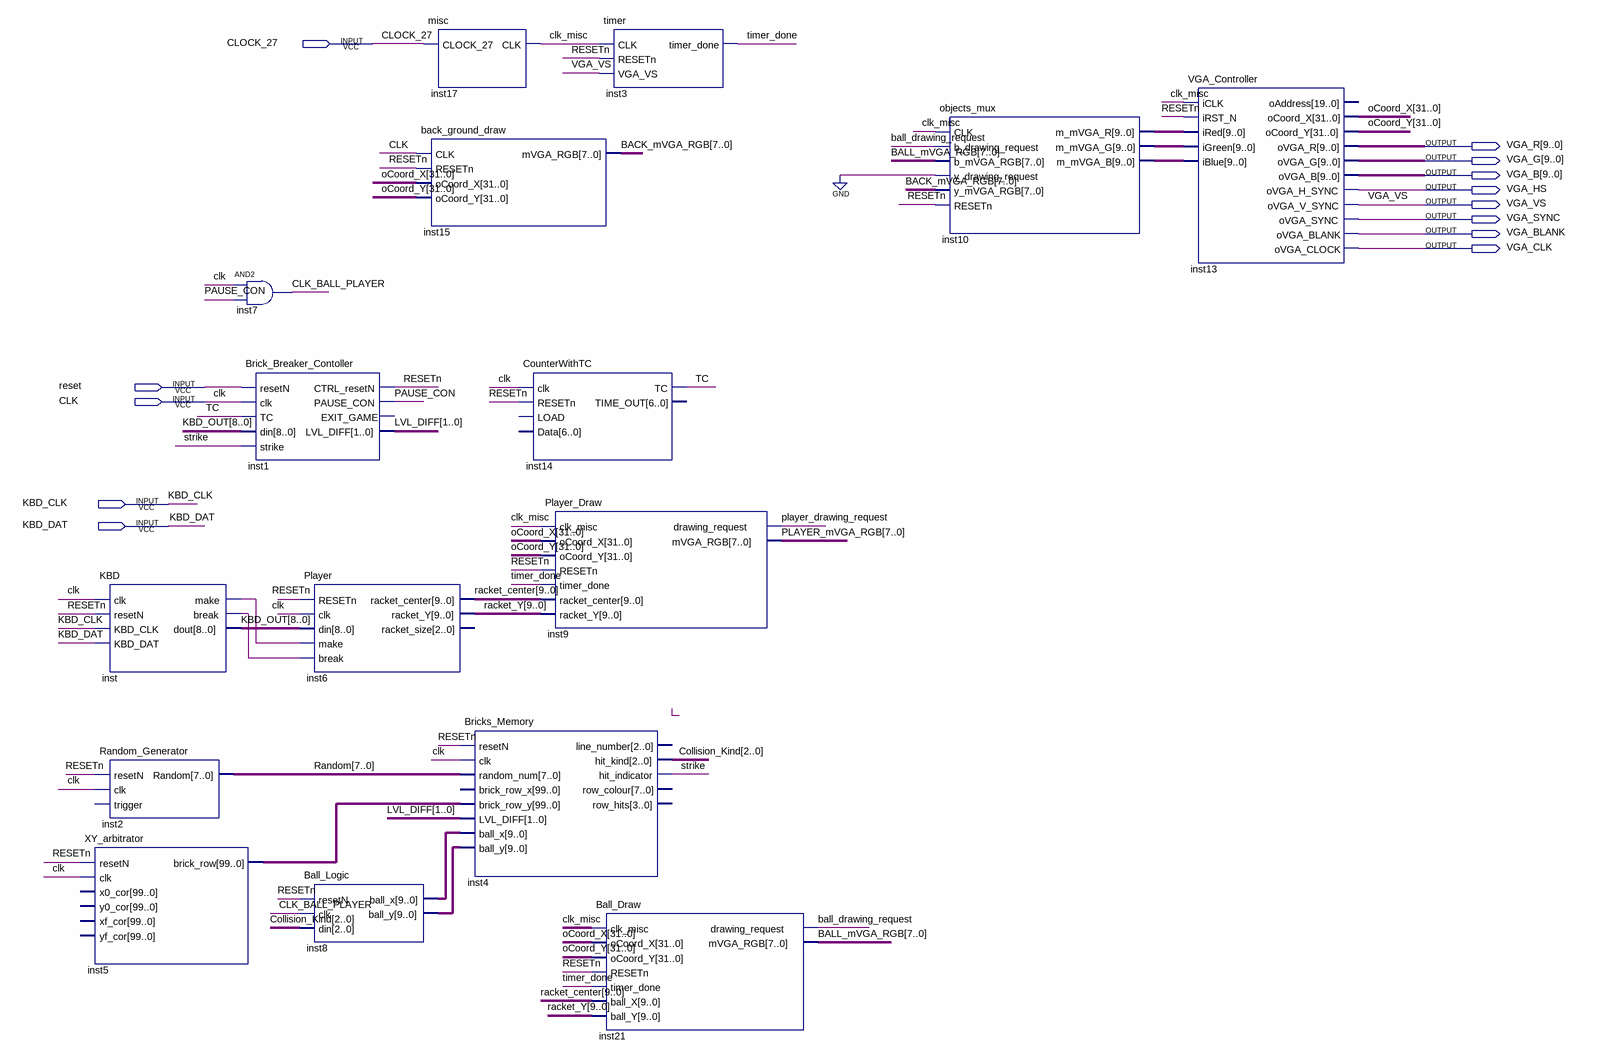
[diagram p0: schematic sheet]
// Quartus schematic Main_Scheme.bdf as structural Verilog: 16 symbols, 13 pins
module Main_Scheme (
  input  CLOCK_27,
  input  reset,
  input  CLK,
  input  KBD_CLK,
  input  KBD_DAT,
  output [9:0] VGA_R,
  output [9:0] VGA_G,
  output [9:0] VGA_B,
  output VGA_HS,
  output VGA_VS,
  output VGA_SYNC,
  output VGA_BLANK,
  output VGA_CLK
);

  wire ball_drawing_request, CLK_BALL_PLAYER, clk_misc, inst_break, inst_make, PAUSE_CON,
       player_drawing_request, RESETn, strike, TC, timer_done;
  wire [1:0] LVL_DIFF;
  wire [2:0] Collision_Kind;
  wire [7:0] BACK_mVGA_RGB, BALL_mVGA_RGB, PLAYER_mVGA_RGB, Random;
  wire [8:0] KBD_OUT;
  wire [9:0] inst8_ball_x, inst8_ball_y, inst10_m_mvga_b, inst10_m_mvga_g, inst10_m_mvga_r, racket_center,
       racket_Y;
  wire [31:0] oCoord_X, oCoord_Y;
  wire [99:0] inst5_brick_row;

  KBD inst (
    .clk(CLK), .resetN(RESETn), .KBD_CLK(KBD_CLK), .KBD_DAT(KBD_DAT), .make(inst_make), .\break (inst_break),
    .dout(KBD_OUT));
  Random_Generator inst2 (.resetN(RESETn), .clk(CLK), .Random(Random));  // open: trigger
  XY_arbitrator inst5 (
    .resetN(RESETn), .clk(CLK), .brick_row(inst5_brick_row));  // open: x0_cor, y0_cor, xf_cor, yf_cor
  and inst7 (CLK_BALL_PLAYER, CLK, PAUSE_CON);
  Brick_Breaker_Contoller inst1 (
    .resetN(reset), .clk(CLK), .TC(TC), .din(KBD_OUT), .strike(strike), .CTRL_resetN(RESETn),
    .PAUSE_CON(PAUSE_CON), .LVL_DIFF(LVL_DIFF));  // open: EXIT_GAME
  Player inst6 (
    .RESETn(RESETn), .clk(CLK), .din(KBD_OUT), .make(inst_make), .\break (inst_break),
    .racket_center(racket_center), .racket_Y(racket_Y));  // open: racket_size
  Ball_Logic inst8 (
    .resetN(RESETn), .clk(CLK_BALL_PLAYER), .din(Collision_Kind), .ball_x(inst8_ball_x), .ball_y(inst8_ball_y));
  misc inst17 (.CLOCK_27(CLOCK_27), .CLK(clk_misc));
  back_ground_draw inst15 (
    .CLK(CLK), .RESETn(RESETn), .oCoord_X(oCoord_X), .oCoord_Y(oCoord_Y), .mVGA_RGB(BACK_mVGA_RGB));
  Bricks_Memory inst4 (
    .resetN(RESETn), .clk(CLK), .random_num(Random), .brick_row_y(inst5_brick_row), .LVL_DIFF(LVL_DIFF),
    .ball_x(inst8_ball_x), .ball_y(inst8_ball_y), .hit_kind(Collision_Kind), .hit_indicator(strike));  // open: brick_row_x, line_number, row_colour, row_hits
  CounterWithTC inst14 (.clk(CLK), .RESETn(RESETn), .TC(TC));  // open: LOAD, Data, TIME_OUT
  Player_Draw inst9 (
    .clk_misc(clk_misc), .oCoord_X(oCoord_X), .oCoord_Y(oCoord_Y), .RESETn(RESETn), .timer_done(timer_done),
    .racket_center(racket_center), .racket_Y(racket_Y), .drawing_request(player_drawing_request),
    .mVGA_RGB(PLAYER_mVGA_RGB));
  timer inst3 (.CLK(clk_misc), .RESETn(RESETn), .VGA_VS(VGA_VS), .timer_done(timer_done));
  Ball_Draw inst21 (
    .clk_misc(clk_misc), .oCoord_X(oCoord_X), .oCoord_Y(oCoord_Y), .RESETn(RESETn), .timer_done(timer_done),
    .ball_X(racket_center), .ball_Y(racket_Y), .drawing_request(ball_drawing_request),
    .mVGA_RGB(BALL_mVGA_RGB));
  objects_mux inst10 (
    .CLK(clk_misc), .b_drawing_request(ball_drawing_request), .b_mVGA_RGB(BALL_mVGA_RGB),
    .y_drawing_request(1'b0), .y_mVGA_RGB(BACK_mVGA_RGB), .RESETn(RESETn), .m_mVGA_R(inst10_m_mvga_r),
    .m_mVGA_G(inst10_m_mvga_g), .m_mVGA_B(inst10_m_mvga_b));
  VGA_Controller inst13 (
    .iCLK(clk_misc), .iRST_N(RESETn), .iRed(inst10_m_mvga_r), .iGreen(inst10_m_mvga_g),
    .iBlue(inst10_m_mvga_b), .oCoord_X(oCoord_X), .oCoord_Y(oCoord_Y), .oVGA_R(VGA_R), .oVGA_G(VGA_G),
    .oVGA_B(VGA_B), .oVGA_H_SYNC(VGA_HS), .oVGA_V_SYNC(VGA_VS), .oVGA_SYNC(VGA_SYNC), .oVGA_BLANK(VGA_BLANK),
    .oVGA_CLOCK(VGA_CLK));  // open: oAddress
endmodule
